# EAGLE design Power+LCD2 (EAGLE 7.5.0)
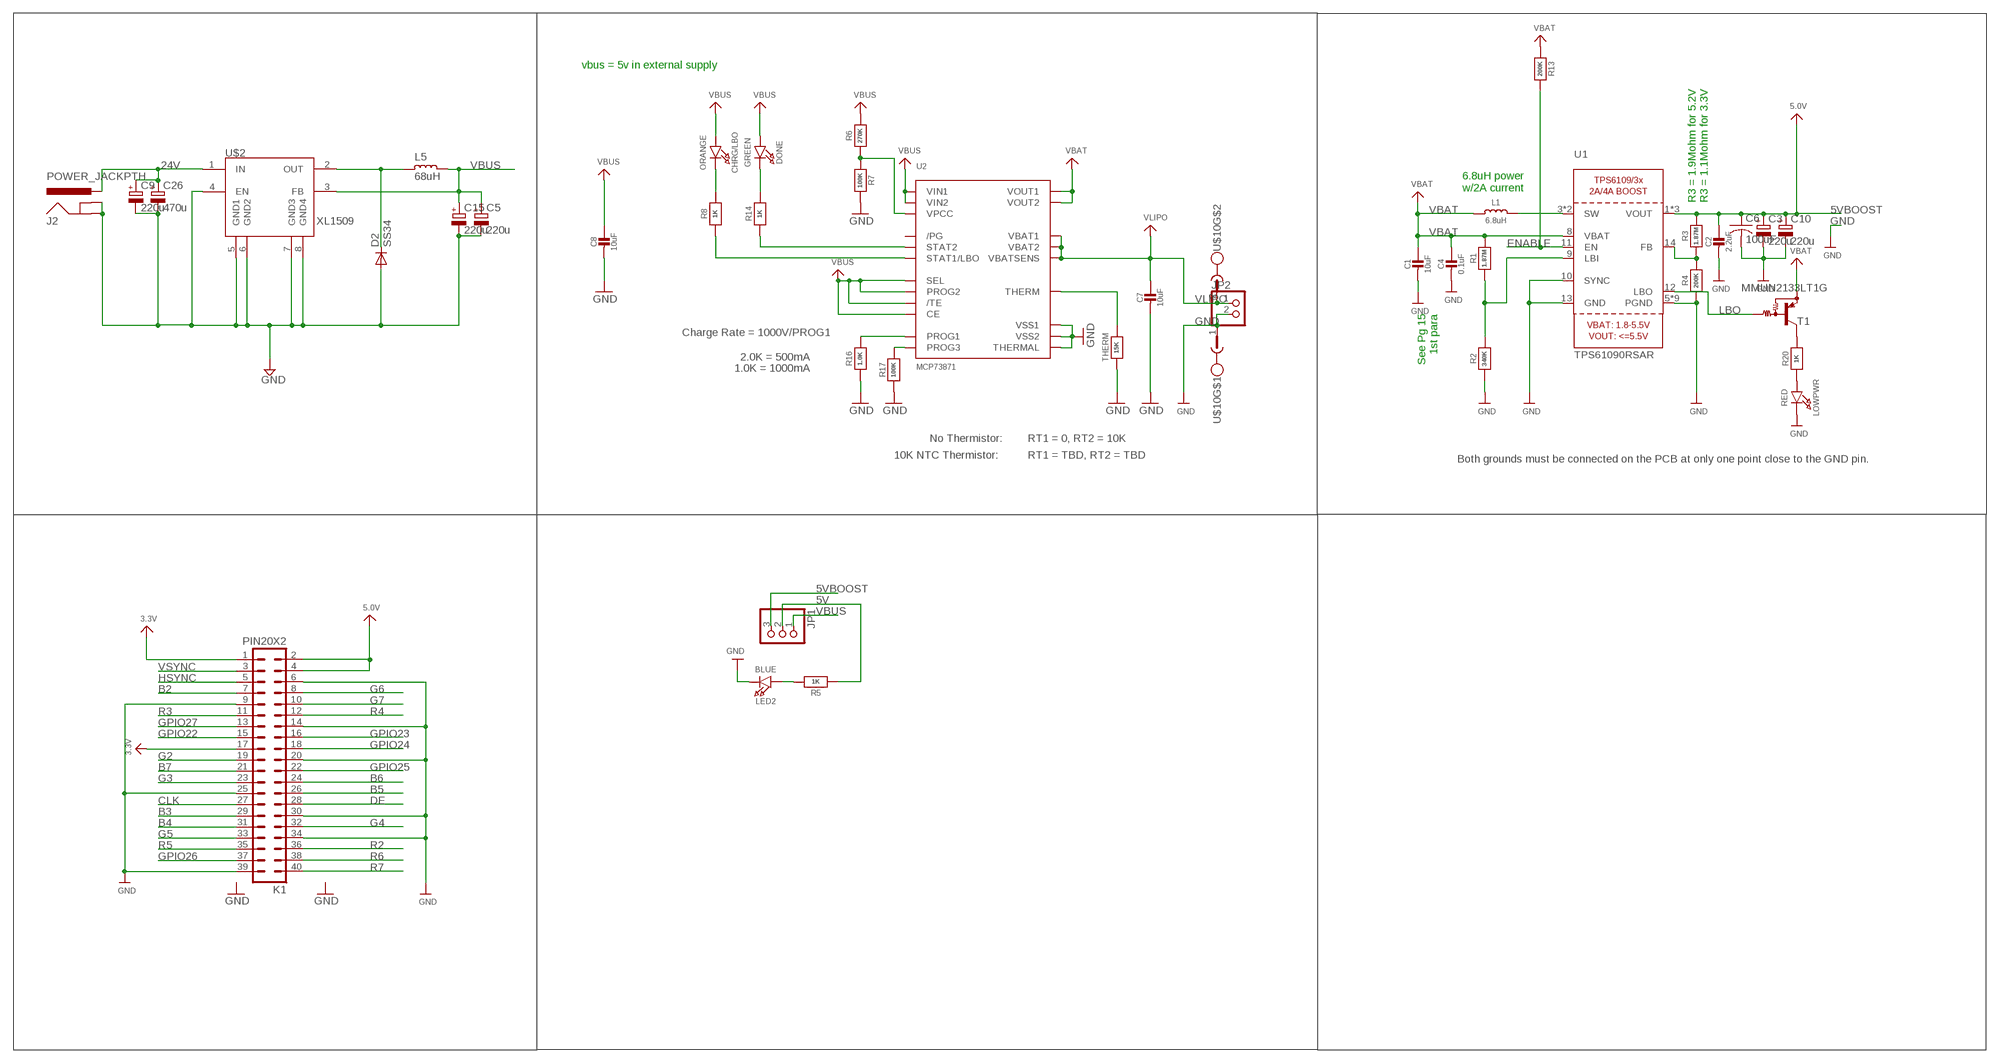
[diagram p0: schematic, sheet 1]

## Parts
C1  10uF  CAP_CERAMIC_1206MP  [_1206MP]
C2  2.2uF  CAP_CERAMIC0805-NOOUTLINE  [0805-NO]
C3  220u  CPOL-EUE2.5-7  [E2,5-7]
C4  0.1uF  CAP_CERAMIC0805_10MGAP  [0805_10MGAP]
C5  220u  CPOL-EUD  [PANASONIC_D]
C6  100uF  C-USC1210  [C1210]
C7  10uF  CAP_CERAMIC_1206MP  [_1206MP]
C8  10uF  CAP_CERAMIC_1206MP  [_1206MP]
C9  220u  CPOL-EUD  [PANASONIC_D]
C10  220u  CPOL-EUD  [PANASONIC_D]
C15  220u  CPOL-EUE2.5-7  [E2,5-7]
C26  470u  CPOL-EUE2.5-7  [E2,5-7]
CHRG/LBO  ORANGE  LED0805_NOOUTLINE  [CHIPLED_0805_NOOUTLINE]
D2  SS34  DIODE-DO-214AC  [DO-214AC]
DONE  GREEN  LED0805_NOOUTLINE  [CHIPLED_0805_NOOUTLINE]
J2  POWER_JACKPTH  [POWER_JACK_PTH]
JP1  PINHD-1X3  [1X03]
JP2  PINHD-1X2  [1X02]
K1  PIN20X2  [PIN_20X2]
L1  6.8uH  INDUCTORTDK_VLC5045  [INDUCTOR_5X5MM_TDK_VLC5045]
L5  68uH  L_CD75  [CD75]
LED2  BLUE  LED0805_NOOUTLINE  [CHIPLED_0805_NOOUTLINE]
LOWPWR  RED  LED0805_NOOUTLINE  [CHIPLED_0805_NOOUTLINE]
R1  1.87M  RESISTOR_0805MP  [_0805MP]
R2  340K  RESISTOR_0805MP  [_0805MP]
R3  1.87M  RESISTOR0805_NOOUTLINE  [0805-NO]
R4  200K  RESISTOR0805_NOOUTLINE  [0805-NO]
R5  1K  RESISTOR0805_NOOUTLINE  [0805-NO]
R6  270K  RESISTOR0805_NOOUTLINE  [0805-NO]
R7  100K  RESISTOR0805_NOOUTLINE  [0805-NO]
R8  1K  RESISTOR0805_NOOUTLINE  [0805-NO]
R13  200K  RESISTOR0805_NOOUTLINE  [0805-NO]
R14  1K  RESISTOR0805_NOOUTLINE  [0805-NO]
R16  1.0K  RESISTOR0805_NOOUTLINE  [0805-NO]
R17  100K  RESISTOR0805_NOOUTLINE  [0805-NO]
R20  1K  RESISTOR0805_NOOUTLINE  [0805-NO]
T1  MMUN2133LT1G  MUN2114T1-PNP_DRIVER-SC59-BEC  [SC59-BEC]
THERM  15K  RESISTOR0805_NOOUTLINE  [0805-NO]
U1  TPS61090RSAR  VREG_TPS6103X  [PVQFN-16]
U2  MCP73871  [QFN20_4MM]
U$2  XL1509  [SO08]
U$10  MC1.5/2  [MC1.5/2-G-3.81]

## Nets
3V3: K1.1 K1.17 ; supply symbol labelled 3.3V
5V: JP1.2 K1.2 K1.4 R5.1 ; supply symbol labelled 5.0V
5VBOOST: C2.1 C3.+ C6.1 C10.+ JP1.3 R3.2 U1.1(VOUT) U1.15(VOUT) U1.16(VOUT) ; supply symbol labelled 5.0V
24V: C9.+ C26.+ J2.PWR U$2.1(IN)
B2: K1.7
B3: K1.29
B4: K1.31
B5: K1.26
B6: K1.24
B7: K1.21
CLK: K1.27
DE: K1.28
ENABLE: R13.2 U1.11(EN)
G2: K1.19
G3: K1.23
G4: K1.32
G5: K1.33
G6: K1.8
G7: K1.10
GND: C1.2 C2.2 C3.- C4.2 C5.- C6.2 C7.2 C8.2 C9.- C10.- C15.- C26.- D2.2(A) J2.GND J2.GNDBREAK JP2.2 K1.6 K1.9 K1.14 K1.20 K1.25 K1.30 K1.34 K1.39 LED2.C LOWPWR.C R2.1 R4.1 R7.2 R16.1 R17.1 THERM.1 U1.5(PGND) U1.6(PGND) U1.7(PGND) U1.10(SYNC) U1.13(GND) U1.P$18(PGND) U1.P$19(PGND) U1.P$20(PGND) U1.P$21(PGND) U1.P$22(PGND) U1.THERMAL(PGND) U2.P$10(VSS1) U2.P$11(VSS2) U2.P$21(THERMAL) U$2.4(EN) U$2.5(GND1) U$2.6(GND2) U$2.7(GND3) U$2.8(GND4) U$10.1
GPIO22: K1.15
GPIO23: K1.16
GPIO24: K1.18
GPIO25: K1.22
GPIO26: K1.37
GPIO27: K1.13
HSYNC: K1.5
LBO: T1.B U1.12(LBO)
N$1: L1.P$2 U1.3(SW) U1.4(SW)
N$2: LOWPWR.A R20.1
N$3: R1.1 R2.2 U1.9(LBI)
N$4: D2.1(C) L5.2 U$2.2(OUT)
N$5: R3.1 R4.2 U1.14(FB)
N$6: R20.2 T1.C
N$7: LED2.A R5.2
N$8: R6.1 R7.1 U2.P$2(VPCC)
N$9: R14.1 U2.P$7(STAT2)
N$10: R16.2 U2.P$13(PROG1)
N$11: R8.1 U2.P$8(STAT1/LBO)
N$19: THERM.2 U2.P$5(THERM)
N$20: DONE.C R14.2
N$21: CHRG/LBO.C R8.2
N$22: R17.2 U2.P$12(PROG3)
R2: K1.36
R3: K1.11
R4: K1.12
R5: K1.35
R6: K1.38
R7: K1.40
VBAT: C1.1 C4.1 L1.P$1 R1.2 R13.1 T1.E U1.8(VBAT) U2.P$1(VOUT1) U2.P$20(VOUT2)
VBUS: C5.+ C8.1 C15.+ CHRG/LBO.A DONE.A JP1.1 L5.1 R6.2 U2.P$3(SEL) U2.P$4(PROG2) U2.P$9(/TE) U2.P$17(CE) U2.P$18(VIN1) U2.P$19(VIN2) U$2.3(FB)
VLIPO: C7.1 JP2.1 U2.P$14(VBAT1) U2.P$15(VBAT2) U2.P$16(VBATSENS) U$10.2
VSYNC: K1.3
Unconnected: U2.P$6(/PG)

## Notes on the sheet
- vbus = 5v in external supply
- 6.8uH power
  w/2A current
- R3 = 1.9Mohm for 5.2V
  R3 = 1.1Mohm for 3.3V
- See Pg 15
  1st para
- Charge Rate = 1000V/PROG1
- 2.0K = 500mA
- 1.0K = 1000mA
- No Thermistor: | RT1 = 0, RT2 = 10K
- 10K NTC Thermistor: | RT1 = TBD, RT2 = TBD | Both grounds must be connected on the PCB at only one point close to the GND pin.

## Library data of the parts
C1 C2 C4 C7 C8 = microbuilder:CAP_CERAMIC: Ceramic Capacitors For new designs, use the packages preceded by an '_' character since they are more reliable: The following footprints should be used on most boards: _0402 - Standard footprint for regular board layouts _0603 - Standard footprint for regular board layouts _0805 - Standard footprint for regular board layouts _1206 - Standard footprint for regular board layouts For extremely tight-pitch boards where space is at a premium, the following 'micro-pitch' footprints can be used (smaller pads, no silkscreen outline, etc.): _0402MP - Micro-pitch footprint for very dense/compact boards _0603MP - Micro-pitch footprint for very dense/compact boards _0805MP - Micro-pitch footprint for very dense/compact boards _1206MP - Micro-pitch footprint for very dense/compact boards
C3 C5 C9 C10 C15 C26 = rcl:CPOL-EU: POLARIZED CAPACITOR, European symbol
C6 = rcl:C-US: CAPACITOR, American symbol
CHRG/LBO DONE LED2 LOWPWR = microbuilder:LED: LED 0603 - 0603 Surface Mount Package 2mA: Green LED - Low Power (3.9mcd, 2ma, 1.7Vf) - Digikey: 475-2709-2-ND Orange LED - Low Power (9.8mcd, 2ma, 1.8Vf) - Digikey: 475-1194-2-ND Red LED - Low Power (5mcd, 2ma, 1.8Vf) - Digikey: 475-1195-2-ND Yellow LED - Low Power (7mcd, 2ma, 1.8Vf) - Digikey: 475-1196-2-ND 5mA: Blue LED - Low Power (17mcd, 5ma, 2.9Vf) - Digikey: LNJ937W8CRACT-ND 0805 - 0805 Surface Mount Package 2mA: Red LED (8.8mcd, 2mA, 1.8Vf, Clear) - Low Power [Digikey: 475-2510-1-ND] Green LED (5mcd, 2mA, 1.8Vf, Clear) - Low Power [Digikey: 475-2730-1-ND] Yellow LED (11.3mcd, 2mA, 1.8Vf, Clear) - Low Power [Digikey: 475-2555-1-ND] 20mA: Red LED (104mcd, 20mA, Diffused) - LS R976 [Digikey: 475-1278-6-ND] Red LED (12mcd, 20mA, 2.0Vf, Clear) - APT2012EC [Digikey: 754-1128-1-ND] Green LED (15mcd, 20mA, 2.2Vf, Clear) - APT2012GC [Digikey: 754-1131-1-ND] Orange LED (160mcd, 20mA, 2.1Vf, Clear) - APT2012SECK [Digikey: 754-1130-1-ND] 1206 - 1206 Surface Mount Package Green LED (26mcd, 20mA, Diffused) - LG N971 [Digikey: 475-1407-6-ND] Red LED (15mcd, 20mA, Diffused) - LH N974 [Digikey: 475-1416-6-ND] Cree - Cree High-Power Surface Mount LEDs XPEBWT-L1-0000-00D50 - White 111lm 350mA 2.9Vf 6200K 110° XTEAWT-00-0000-00000LEE3 - White 114lm 350mA 2.85Vf 5000K 115° Everlight - Everlight 45-21 Series Surface Mount LEDs 45-21/QK2C-B2832AC2CB2/2T - Warm White 2000mcd 20mA 3.25Vf 3050K 120° 45-21/LK2C-B38452C4CB2/2T - Nuetral White 2000mcd 20mA 3.25Vf 4150K 120° 45-21/LK2C-B50634C6CB2/2T - Cold White 2200mcd 20mA 3.25Vf 5650K 120° PLCC2 Reverse Mount LS T77K-J1L2-1-0-2-R18-Z - Red 11.25mcd 2mA 1.8Vf 630nm 120° LO T77K-L1M2-24-Z - Orange 19.6mcd 2mA 1.8Vf 606nm 120° LY T77K-K2M1-26-Z - Yellow 15.7mcd 2mA 1.8Vf 587nm 120°
D2 = dp_devices:DIODE: Various Diode Packages
J2 = SparkFun-Connectors:POWER_JACK: Power Jack This is the standard 5.5mm barrel jack for power. The PTH is the most common, proven, reliable, footprint. The Slot footprint only works if the mill layer is transmitted to the PCB fab house so be warned. Mating wall wart : TOL-00298 (and others); PROD_ID: CONN-08197
JP1 = pinhead:PINHD-1X3: PIN HEADER
JP2 = pinhead:PINHD-1X2: PIN HEADER
K1 = FLYFISH:PIN20X2
L1 = microbuilder:INDUCTOR: Inductors 0603: 10nH Ceramic Inductor - microwire antenna/RF (Digikey: 712-1434-2-ND) 0805: 560nH Ceramic Inductor - RF (Digikey: 553-1047-1-ND) 270nH Ceramic Inductor - Q = 40@250MHz, +-5%, 1 Ohm DC Resistance (Digikey: 535-10506-2-ND) 1007 (2518 Metric) SMT: 10µH 10% 250mOhm 820mA 1007 Inductor (Digikey: 587-2189-1-ND) 22µH 10% 500mOhm 580mA 1007 Inductor (Digikey: 587-2190-1-ND) 47µH 10% 950mOhm 420mA 1007 Inductor (Digikey: 587-2191-1-ND) 47µH 5% 100mOhm 1A 1008 Inductor (Digikey: 732-1816-1-ND) 5.0x5.0mm (Taiyo Yuden NR5040 Series) 6.8µH 20% 2.3A 64mOhm Inductor (Digikey: 587-2374-2-ND) 5.0x5.0mm (TDK VLC5045 Series) 4.7µH 20% 3.3A 34mOhm Inductor (Digikey: 445-6526-1-ND) 6.8µH 20% 2.7A 46mOhm Inductor (Digikey: 445-6527-1-ND) 6.0x6.0mm (TDK VLC6045 Series) 4.7µH 20% 3.8A 27mOhm Inductor (Digikey: 445-6538-2-ND) 6.8µH 20% 3A 41mOhm Inductor (Digikey: 445-6540-1-ND) 6.2µH 30% 2.2A 45mOhm Inductor (Digikey: SRR5028-6R2YCT-ND) - Not TDK VLC6045 but footprint should match 6.0x6.0mm (TDK SLF6045 Series) 6.8uH 30% 2A 33mOhm Inductor (Digikey: 445-4572-1-ND, Mouser: 810-SLF645T6R8N2R0PF) 6.0x6.0mm (Sumida CDRH5D28 Series) 6.2uH 30% 1.8A 45mOhm Inductor (Digikey: 308-1542-1-ND) Taiyo Yuden NR3015T2R2M - 2.2uH 20% 1.5A (Digikey: 587-1648-2-ND, Mouser: 963-NR3015T2R2M) - Used with TI TPS62172 CoilCraft RFID Transponder Coil - MA5532-AE (For use with AS3935 Lightning Sensor) Vishay IHLP 1.0uH Molded Inductor - 24mOhm DCR, 5A, +/-20%, -55°C-125°C (Digikey: 541-1319-1-ND)
L5 = rc-master-smd:L_: INDUCTOR
R1-R8 R13 R14 R16 R17 R20 THERM = microbuilder:RESISTOR: Resistors For new designs, use the packages preceded by an '_' character since they are more reliable: The following footprints should be used on most boards: _0402 - Standard footprint for regular board layouts _0603 - Standard footprint for regular board layouts _0805 - Standard footprint for regular board layouts _1206 - Standard footprint for regular board layouts For extremely tight-pitch boards where space is at a premium, the following 'micro-pitch' footprints can be used (smaller pads, no silkscreen outline, etc.): _0402MP - Micro-pitch footprint for very dense/compact boards _0603MP - Micro-pitch footprint for very dense/compact boards _0805MP - Micro-pitch footprint for very dense/compact boards _1206MP - Micro-pitch footprint for very dense/compact boards
T1 = transistor:*-PNP_DRIVER-: PNP Bias Resistor Transistor
U1 = microbuilder:VREG_TPS6103X: TPS6103x 4A Boost - 1.8-5.5V Input, Adjustable Output to 5.5V
U2 = microbuilder:MCP73871: MCP73871 Lithium Polymer Battery Charger Digikey: MCP73871-2CCI/ML-ND
U$2 = Cohesion_parts:XL1509
U$10 = jt-con-phoenix-3.81:MC1.5/2

## Board
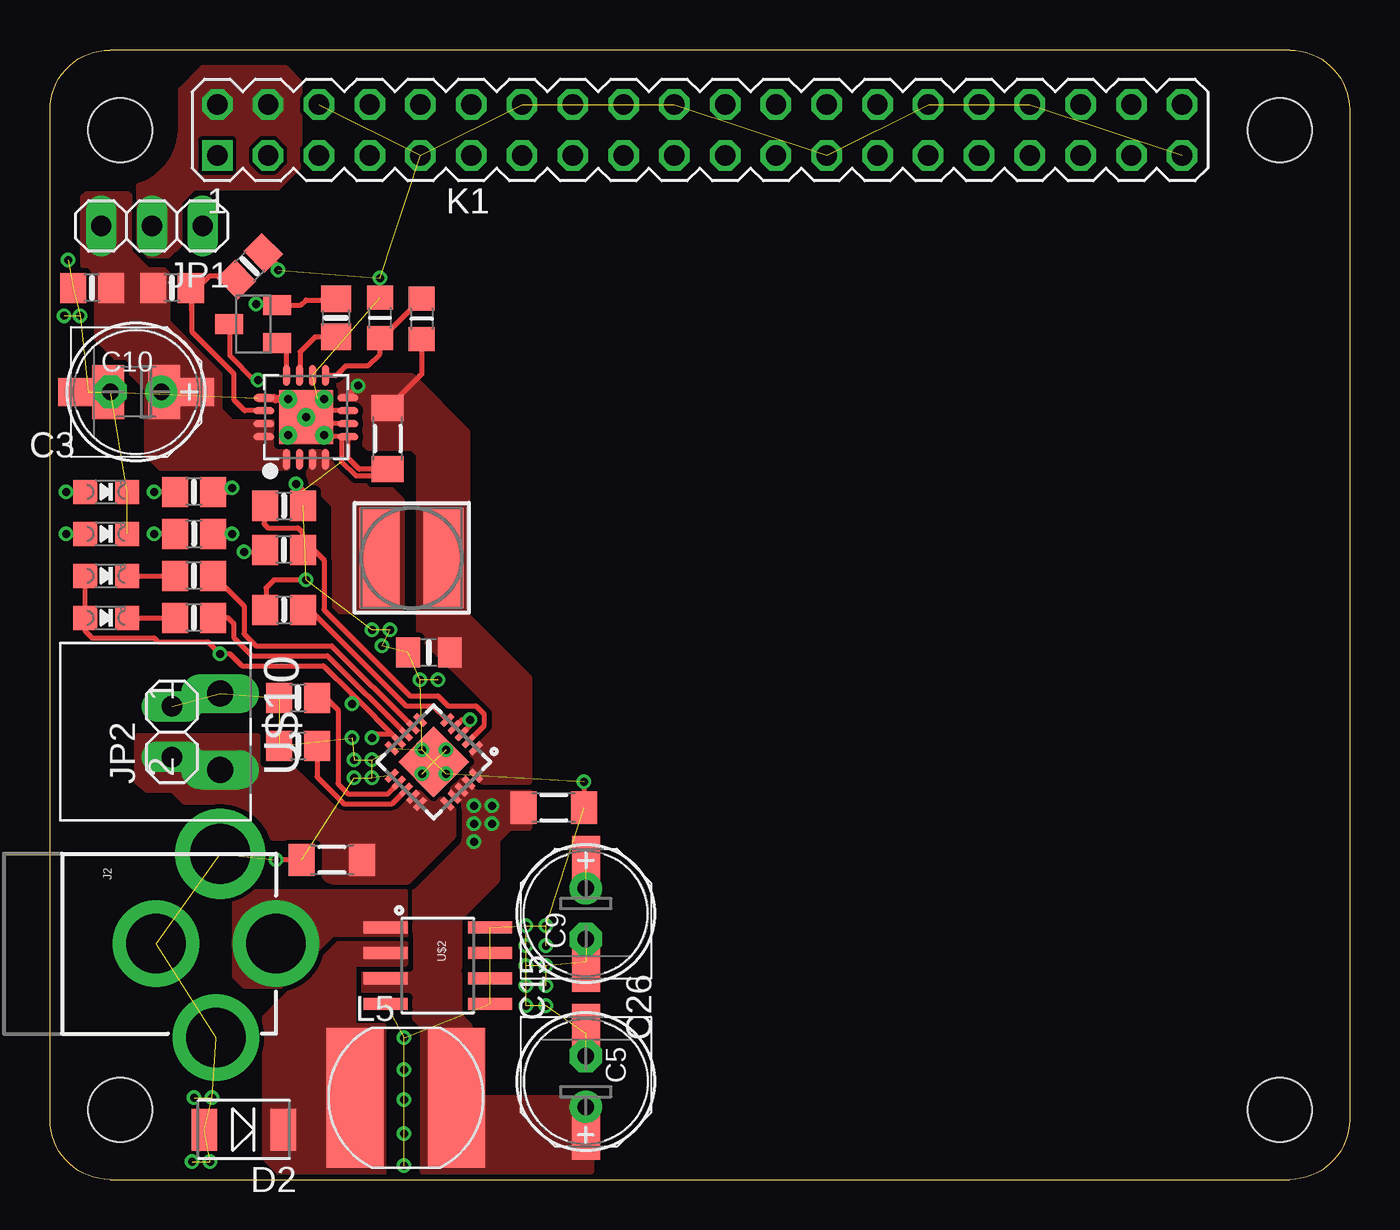
[diagram p1: board, top side]
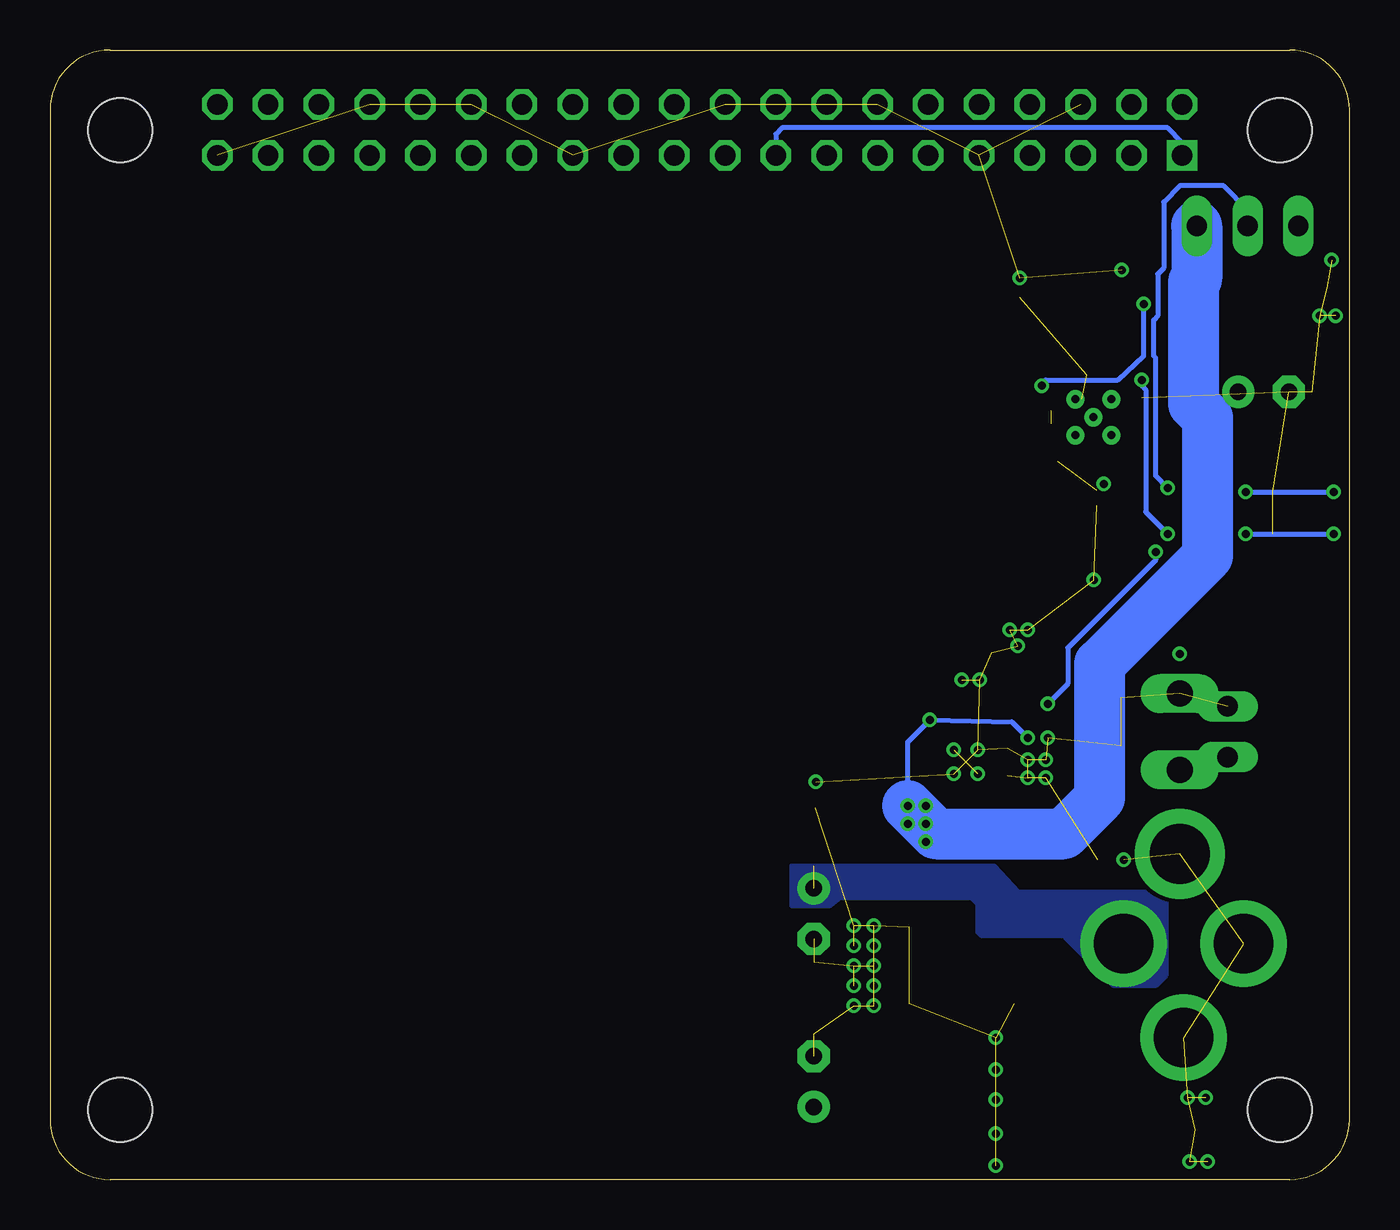
[diagram p2: board, bottom side, seen from below]

Size 65 x 56.5 mm. Coordinates in mm from the lower left corner, seen from the top.
Outline: 0,53.5 arc-90 3,56.5 62,56.5 arc-90 65,53.5 65,3 arc-90 62,0 3,0 arc-90 0,3 0,53.5
Copper layers (1*16): Top 0.035mm / dielectric 1.5mm / Bottom 0.035mm
Design rules "ITEADstudio_DRC *": minimum track width 6mil, minimum drill 12mil, track to track 8mil, track to pad 8mil, pad to pad 8mil, via to via 8mil, smd to smd 0mil, copper to edge 10mil, drill to drill 10mil, minimum pad ring 10mil, minimum via ring 6mil, stop-mask expansion 2mil, vias tented up to drill 100mil, thermal gap 10mil
Holes 3.2 mm at 3.5,3.5 61.5,3.5 61.5,52.5 3.5,52.5
tRestrict: area 1.5,50.5 to 5.5,54.5; area 59.5,50.5 to 63.5,54.5; area 59.5,1.5 to 63.5,5.5; area 1.5,1.5 to 5.5,5.5
bRestrict: area 1.5,1.5 to 5.5,5.5; area 59.5,1.5 to 63.5,5.5; area 59.5,50.5 to 63.5,54.5; area 1.5,50.5 to 5.5,54.5; 20 lines

### Footprints (pad centres in the part's own frame; a part is rotated, then mirrored left to right if it is on the bottom)
_1206MP = smd 1.3 x 1.6: 1 -1.524,0; 2 1.524,0
0805-NO = smd 1.3 x 1.5: 1 -0.95,0; 2 0.95,0
E2,5-7 = drill 0.813 pad 1.6: + -1.27,0 | drill 0.813 pad 1.6 octagon: - 1.27,0
0805_10MGAP = smd 1.2 x 1.5: 1 -1.05,0; 2 1.05,0
PANASONIC_D = smd 3 x 1.4: + 2.4,0; - -2.4,0
C1210 = smd 1.6 x 2.7: 1 -1.4,0; 2 1.4,0
CHIPLED_0805_NOOUTLINE = smd 1.2 x 1.2: A 0,-1.05; C 0,1.05
DO-214AC = smd 1.27 x 2.1: 1 -1.98,0; 2 1.98,0
POWER_JACK_PTH = drill 2.997 pad 4.318: GND 0,7.7; GNDBREAK 4.7,10.7; PWR 0,13.7
1X03 = drill 1.016 long: 1 -2.54,0; 2 0,0; 3 2.54,0
1X02 = drill 1.016 long: 1 -1.27,0; 2 1.27,0
PIN_20X2 = drill 1.016 square: 1 -24.13,-1.27 | drill 1.016 octagon: 2 -24.13,1.27; 3 -21.59,-1.27; 4 -21.59,1.27; 5 -19.05,-1.27; 6 -19.05,1.27; 7 -16.51,-1.27; 8 -16.51,1.27; 9 -13.97,-1.27; 10 -13.97,1.27; 11 -11.43,-1.27; 12 -11.43,1.27; 13 -8.89,-1.27; 14 -8.89,1.27; 15 -6.35,-1.27; 16 -6.35,1.27; 17 -3.81,-1.27; 18 -3.81,1.27; 19 -1.27,-1.27; 20 -1.27,1.27; 21 1.27,-1.27; 22 1.27,1.27; 23 3.81,-1.27; 24 3.81,1.27; 25 6.35,-1.27; 26 6.35,1.27; 27 8.89,-1.27; 28 8.89,1.27; 29 11.43,-1.27; 30 11.43,1.27; 31 13.97,-1.27; 32 13.97,1.27; 33 16.51,-1.27; 34 16.51,1.27; 35 19.05,-1.27; 36 19.05,1.27; 37 21.59,-1.27; 38 21.59,1.27; 39 24.13,-1.27; 40 24.13,1.27
INDUCTOR_5X5MM_TDK_VLC5045 = smd 2 x 5: P$1 -1.6,0; P$2 1.6,0
CD75 = smd 7 x 2.85: 1 0,2.54; 2 0,-2.54
_0805MP = smd 1.2 x 1.3: 1 -1.016,0; 2 1.016,0
SC59-BEC = smd 1 x 1.4: B -0.95,-1.2; C 0,1.2; E 0.95,-1.2
PVQFN-16 = smd 1.05 x 0.35: 1 -2.1,0.975; 2 -2.1,0.325; 3 -2.1,-0.325; 4 -2.1,-0.975; 9 2.1,-0.975; 10 2.1,-0.325; 11 2.1,0.325; 12 2.1,0.975 | smd 0.35 x 1.05: 5 -0.975,-2.1; 6 -0.325,-2.1; 7 0.325,-2.1; 8 0.975,-2.1; 13 0.975,2.1; 14 0.325,2.1; 15 -0.325,2.1; 16 -0.975,2.1 | drill 0.4: P$18 0,0; P$19 -0.9,0.9; P$20 0.9,0.9; P$21 0.9,-0.9; P$22 -0.9,-0.9 | smd 2.7 x 2.7: THERMAL 0,0
QFN20_4MM = smd 0.73 x 0.28: P$1 -1.965,1; P$2 -1.965,0.5; P$3 -1.965,0; P$4 -1.965,-0.5; P$5 -1.965,-1; P$11 1.965,-1; P$12 1.965,-0.5; P$13 1.965,0; P$14 1.965,0.5; P$15 1.965,1 | smd 0.28 x 0.73: P$6 -1,-1.965; P$7 -0.5,-1.965; P$8 0,-1.965; P$9 0.5,-1.965; P$10 1,-1.965; P$16 1,1.965; P$17 0.5,1.965; P$18 0,1.965; P$19 -0.5,1.965; P$20 -1,1.965 | smd 2.5 x 2.5: P$21 0,0
SO08 = smd 0.61 x 2.21: 1 -1.905,-2.616; 2 -0.635,-2.616; 3 0.635,-2.616; 4 1.905,-2.616; 5 1.905,2.616; 6 0.635,2.616; 7 -0.635,2.616; 8 -1.905,2.616
MC1.5/2-G-3.81 = drill 1.3 long: 1 -3.81,8; 2 0,8

### Placement (x,y rotation side)
C1  16.89,37.06 270 top
C2  2.1,44.6 180 top
C3  4.3,39.4 180 top
C4  18.95,26.36 180 top
C5  26.8,4.9 270 top
C6  4.3,39.4 180 top
C7  14.1,16 180 top
C8  25.2,18.6 0 top
C9  26.8,13.3 90 top
C10  4.3,39.4 0 top
C15  26.8,4.9 90 top
C26  26.8,13.3 270 top
CHRG/LBO  2.8,28.1 270 top
D2  9.7,2.5 180 top
DONE  2.8,30.2 270 top
J2  -2.4,11.8 270 top
JP1  5.1,47.7 180 top
JP2  6.1,22.4 90 top
K1  32.5,52.5 0 top
L1  18.1,31.1 180 top
L5  17.8,4.1 270 top
LED2  2.8,34.4 270 top
LOWPWR  2.8,32.3 270 top
R1  18.59,43.06 270 top
R2  16.5,43.1 270 top
R3  6.1,44.6 180 top
R4  10,45.68 225 top
R5  7.2,34.4 180 top
R6  11.7,31.5 180 top
R7  11.7,33.7 0 top
R8  7.2,28.1 180 top
R13  14.3,43.1 270 top
R14  7.2,30.2 180 top
R16  12.4,21.7 0 top
R17  12.4,24.1 0 top
R20  7.2,32.3 0 top
T1  10.17,42.8 90 top
THERM  11.7,28.5 0 top
U1  12.81,38.13 90 top
U2  19.2,20.89 225 top
U$2  19.4,10.7 270 top
U$10  0.5,20.5 270 top

### Tracks (layer width: path | path; a pad name or v marks a point on that pad's centre or on a via)
3V3
  Bottom 0.254: K1.1 8.37,51.37 8.4,51.9 9.1,52.6 28.4,52.6 28.7,52.3 K1.17
5V  (via drill 0.4)
  Top 0.254: R5.1 8.9,34.4 v9.1,34.6
  Bottom 0.254: v9.1,34.6 9.7,35.2 9.7,41.1 9.8,41.2 9.8,43 9.6,43.2 9.6,45.3 9.3,45.6 9.3,48.9 8.5,49.7 6.3,49.7 5.1,48.5 JP1.2
  pour Top (rank 3, no thermals): 4.5,46.2 5.9,46.2 6.5,46.8 6.5,48.9 7.2,49.6 11.4,49.6 12.5,50.7 12.5,54.9 11.8,55.6 7.6,55.6 6.5,54.5 6.5,52.3 arc-67 4.4,49.7 4.4,46.3
5VBOOST
  Top 0.305: 11.8,36 U1.1
  pour Top (isolate 0.254, no thermals): 11.9,36.5 11.3,36.5 11.3,37.9 9.1,37.9 8.5,38.5 8.5,40.4 6.9,41.9 5.9,42.9 5.9,45.3 5.7,45.5 4.9,45.5 4,46.4 4,49.2 3.9,49.3 1.8,49.3 1.6,49.1 1.6,45.8 2.3,45.1 2.3,42.1 4.8,39.6 4.8,36.3 5.5,35.6 11.9,35.6
24V  (1 unrouted)
  pour Bottom (rank 2, no thermals): 9.2,14.1 9.2,10.2 9.7,9.7 11.8,9.7 14.2,12.1 14.2,12.2 18.4,12.2 18.6,12.4 18.6,13.8 18.9,14.1 25.5,14.1 26,13.7 27.9,13.7 27.9,15.7 17.8,15.7 16.6,14.4 9.5,14.4
  pour Top (rank 3, no thermals): 9.2,14.1 9.2,10.2 9.7,9.7 11.8,9.7 14.2,12.1 14.2,12.2 17.8,12.2 17.8,14.4 9.5,14.4
ENABLE
  Top 0.254: R13.2 13.25,42.15 12.5,41.4 12.5,40.25 U1.11
GND  (via drill 0.4, 3 pad 4.5)  (79 unrouted)
  Top 0.254: U1.13 11.67,39.1 11.87,38.91 11.87,38.99 U1.P$20 | 13.13,38.79 13.14,38.78 13.39,39.03 U1.P$21 13.78,38.96 13.78,38.52 13.85,38.45 U1.7 | U1.6 13.56,37.8 13.39,37.63 | 14.58,37.15 U1.5 14.9,36.1 15.47,35.53 C1.2 | 14.58,37.15 13.78,37.15 U1.P$22 | 14.58,37.15 14.58,35.92 15.3,35.2 16.7,35.2 16.9,35.4 16.9,35.6 | R7.2 12.65,34.45 v12.3,34.8 | v11.4,45.5 arc60 R4.1 | v12.8,30 11.2,30 10.8,29.6 10.8,28.45 THERM.1 | C7.2 v11.3,16 | v26.7,19.9 26.7,18.62 C8.2 | v16.5,45.1 R2.1
  Top 0.406: U1.P$22 13.71,37.32 13.39,37.63 | 13.13,38.79 13.13,38.45 U1.THERMAL | 11.87,38.91 12.03,38.91 U1.THERMAL | U1.P$19 U1.THERMAL | U1.P$20 11.27,39.03 11.2,39.1 10.4,39.1 U1.13
  other vias: 18.6,21.5 18.6,20.3 19.8,20.3 19.8,21.5 7.2,4.1 8.1,4.1 7.1,0.9 8,0.9 17.7,0.7 17.7,2.3 17.7,4 17.7,5.5 17.7,7.1 23.8,9.7 23.8,8.7 23.8,12.7 16.1,20.1 15.2,20.1 15.2,21 15.1,22.1 16.1,21 23.8,10.7 23.8,11.7 0.7,43.2 0.9,46 17,27.5 16.1,27.5 18.5,25 1.5,43.2 16.6,26.7 24.8,12.7 24.8,11.7 24.8,10.7 24.8,9.7 24.8,8.7 19.4,25 8.5,16.3
LBO
  Top 0.254: U1.12 11.83,41.37 11.4,41.8 11.4,41.81 T1.B
N$1
  pour Top (isolate 0.254, rank 2, no thermals): 12.9,36.5 13.4,36.5 15.1,34.8 16.8,34.8 17.6,34 17.6,28.6 17.4,28.4 14.5,28.4 14.2,28.7 14.2,33.7 12.9,35
N$2  (via drill 0.4)
  Top 0.254: R20.1 v5.2,32.3 | v0.8,32.3 LOWPWR.A
  Bottom 0.254: v5.2,32.3 v0.8,32.3
N$3
  Top 0.254: U1.9 14.33,40.23 14.8,40.7 15.9,40.7 16.5,41.3 R2.2 16.61,42.08 R1.1
N$4
  pour Top (isolate 0.254, no thermals): 17.8,11.8 14.4,11.8 10.7,8.1 10.7,1.1 11.5,0.3 16.7,0.3 16.7,7.7 15.2,7.7 15.2,10.8 17.8,10.8
N$5
  Top 0.254: U1.14 9.75,38.45 9.2,39 9.2,40.3 7.1,42.4 7.1,43.05 | 7.1,43.05 R3.1 | 7.1,43.05 7.1,44.3 8,45.2 9.04,45.2 R4.2
N$6  (via drill 0.4)
  Top 0.254: v9.1,32.3 R20.2 | v10.4,40 10.2,40 9,41.2 9,42.76 T1.C
  Bottom 0.254: v10.4,40 10.4,39.7 10.2,39.5 10.2,33.4 v9.1,32.3
N$7  (via drill 0.4)
  Top 0.254: R5.2 v5.2,34.4 | v0.8,34.4 LED2.A
  Bottom 0.254: v5.2,34.4 v0.8,34.4
N$8
  Top 0.254: U2.P$2 21.7,22.68 21.7,23.3 21.3,23.7 19.9,23.7 19.4,24.2 18,24.2 13.7,28.5 13.7,31 13.2,31.5 R6.1 12.6,30.95 12.6,32.4 12.4,32.6 10.9,32.6 10.7,32.8 10.7,33.5 10.75,33.65 | R7.1 10.75,33.65 | 10.75,33.65 10.8,33.7
N$9
  Top 0.254: U2.P$7 14.09,26.7 10.3,26.7 9.7,27.3 9.7,28.7 8.8,29.6 8.75,29.6 R14.1
N$10
  Top 0.254: U2.P$13 17.11,18.8 14.7,18.8 13.35,20.15 R16.2
N$11
  Top 0.254: U2.P$8 13.89,26.2 10.1,26.2 9.2,27.1 9.2,27.8 8.9,28.1 R8.1
N$19
  Top 0.254: THERM.2 13,28.5 17.8,23.7 19.17,23.7 U2.P$5
N$20
  Top 0.254: DONE.C R14.2
N$21
  Top 0.254: CHRG/LBO.C R8.2
N$22
  Top 0.254: U2.P$12 16.9,19.3 14.9,19.3 14.4,19.8 14.4,23.5 13.6,24.3 R17.2
VBAT  (via drill 0.4)
  Top 0.254: U1.8 14.9,39.2 v15.4,39.7 | v10.3,43.8 11.31,43.8 T1.E 12.55,43.75 12.8,44 14.2,44 R13.1 | R1.2 18.59,40.29 C1.1
  Top 0.406: U1.8
  Bottom 0.254: v15.4,39.7 15.4,39.8 15.2,40 11.6,40 10.3,41.2 v10.3,43.8
  pour Top (isolate 0.254, no thermals): 14.4,40 14.4,39.1 14.6,38.9 15.5,38.9 15.7,38.7 15.7,36.8 15.9,36.6 18.1,36.6 18.4,36.3 18.4,27.3 22.2,23.5 22.2,22.5 21,21.3 21,20.5 21.6,19.9 24,19.9 24,25.1 20.9,28.2 20.9,37.4 18.1,40.2 14.6,40.2
VBUS  (via drill 0.4)
  Top 0.254: 15.1,24.28 13.68,25.7 9.6,25.7 9,26.3 v8.5,26.3 7.9,26.9 5.4,26.9 5.2,27.1 2.1,27.1 1.75,27.45 CHRG/LBO.A DONE.A | 15.1,24.28 U2.P$9 17.08,22.3 16.3,22.3 v16.1,22.1 | U2.P$4 20.6,23 v21,23 21,22.69 U2.P$3 | v9.7,31.4 10.5,31.4 R6.2 | v15.1,23.8 15.1,24.28
  Bottom 0.254: v16.1,22.1 16.9,22.9 v21,23 22.1,21.9 v22.1,18.7 | v9.7,31.4 9.7,31 14.1,26.6 14.1,24.8 v15.1,23.8
  Bottom 2.54: v22.1,18.7 20.7,17.3 14.3,17.3 12.5,19.1 12.5,25.8 7.1,31.2 7.1,38.1 7.8,38.8 7.8,44.9 7.64,45.06 JP1.1
  other vias: 22.1,17.8 21.2,17.8 21.2,18.7 21.2,16.9
  pour Top (isolate 0.254, rank 2, no thermals): 21,4.1 21,7.7 20.5,8.2 20.5,10.3 20.4,10.4 20.4,10.5 20.5,10.6 20.5,13.1 22.4,15 22.4,17 23,17.6 24,17.6 24,19.4 21.6,19.4 20.8,20.2 20.7,20.2 20,19.5 20,19.3 20.7,18.6 20.7,17 18.2,14.5 18.2,10.7 17.9,10.4 15.6,10.4 15.6,9.5 15.7,9.4 18,9.4 18.2,9.2 18.2,8.1 18.6,7.7 18.6,0.4 27.1,0.4 27.1,4.1
VLIPO
  pour Top (no thermals): 18.4,19.4 17.4,18.4 14.4,18.4 12.2,20.5 10.8,20.5 arc-106 10.4,20.9 10.4,22.2 4.4,22.2 4.3,22.1 4.3,19.9 4.8,19.5 6.1,19.5 6.7,18.9 8.5,18.9 arc-72 11.1,17.1 13.2,17.1 arc-108 13.7,16.6 13.7,15.2 arc67 14.2,14.9 17.9,14.9 20.2,17.2 20.2,18.5 19.3,19.4

### Text on the board
tStop: BATTLOW | PWRON | FULL | CHARGE
routoute: USE LITHIUM | BYPASS LITHIUM | PWR | BATTLOW | FULL | CHARGE | +BATT- | +